# EAGLE design shift register (EAGLE 9.5.2)
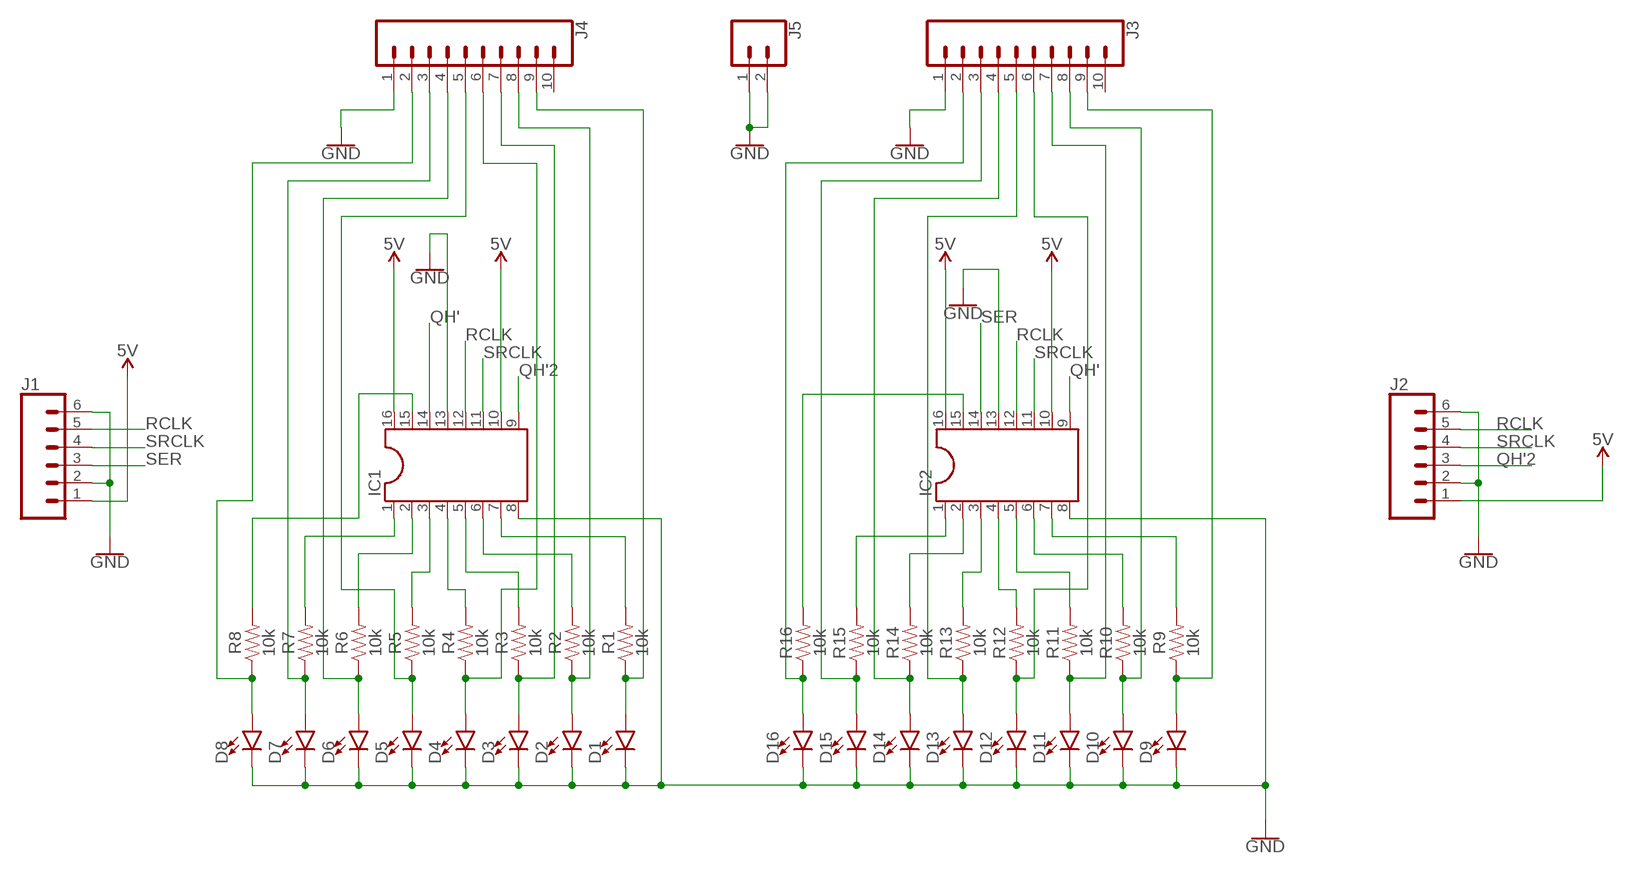
[diagram p0: schematic, sheet 1]

## Parts
D1  LED3MM  [LED_3MM]
D2  LED3MM  [LED_3MM]
D3  LED3MM  [LED_3MM]
D4  LED3MM  [LED_3MM]
D5  LED3MM  [LED_3MM]
D6  LED3MM  [LED_3MM]
D7  LED3MM  [LED_3MM]
D8  LED3MM  [LED_3MM]
D9  LED3MM  [LED_3MM]
D10  LED3MM  [LED_3MM]
D11  LED3MM  [LED_3MM]
D12  LED3MM  [LED_3MM]
D13  LED3MM  [LED_3MM]
D14  LED3MM  [LED_3MM]
D15  LED3MM  [LED_3MM]
D16  LED3MM  [LED_3MM]
IC1  DIL16  [DIL16]
IC2  DIL16  [DIL16]
J1  CONN_06SILK_FEMALE_PTH  [1X06]
J2  CONN_06SILK_FEMALE_PTH  [1X06]
J3  CONN_10"  [1X10]
J4  CONN_10"  [1X10]
J5  CONN_02  [1X02]
R1  10k  10KOHM-HORIZ-1/6W-5%  [AXIAL-0.3]
R2  10k  10KOHM-HORIZ-1/6W-5%  [AXIAL-0.3]
R3  10k  10KOHM-HORIZ-1/6W-5%  [AXIAL-0.3]
R4  10k  10KOHM-HORIZ-1/6W-5%  [AXIAL-0.3]
R5  10k  10KOHM-HORIZ-1/6W-5%  [AXIAL-0.3]
R6  10k  10KOHM-HORIZ-1/6W-5%  [AXIAL-0.3]
R7  10k  10KOHM-HORIZ-1/6W-5%  [AXIAL-0.3]
R8  10k  10KOHM-HORIZ-1/6W-5%  [AXIAL-0.3]
R9  10k  10KOHM-HORIZ-1/6W-5%  [AXIAL-0.3]
R10  10k  10KOHM-HORIZ-1/6W-5%  [AXIAL-0.3]
R11  10k  10KOHM-HORIZ-1/6W-5%  [AXIAL-0.3]
R12  10k  10KOHM-HORIZ-1/6W-5%  [AXIAL-0.3]
R13  10k  10KOHM-HORIZ-1/6W-5%  [AXIAL-0.3]
R14  10k  10KOHM-HORIZ-1/6W-5%  [AXIAL-0.3]
R15  10k  10KOHM-HORIZ-1/6W-5%  [AXIAL-0.3]
R16  10k  10KOHM-HORIZ-1/6W-5%  [AXIAL-0.3]

## Nets
5V: IC1.10 IC1.16 IC2.10 IC2.16 J1.1 J2.1
GND: D1.K(C) D2.K(C) D3.K(C) D4.K(C) D5.K(C) D6.K(C) D7.K(C) D8.K(C) D9.K(C) D10.K(C) D11.K(C) D12.K(C) D13.K(C) D14.K(C) D15.K(C) D16.K(C) IC1.8 IC1.13 IC2.8 IC2.13 J1.2 J1.6 J2.2 J2.6 J3.1 J4.1 J5.1 J5.2
N$1: IC1.7 R1.P$2
N$2: D9.A J3.9 R9.P$1
N$4: D7.A J4.3 R7.P$1
N$5: D6.A J4.4 R6.P$1
N$6: D5.A J4.5 R5.P$1
N$7: D4.A J4.6 R4.P$1
N$8: D3.A J4.7 R3.P$1
N$9: D2.A J4.8 R2.P$1
N$10: D10.A J3.8 R10.P$1
N$11: D11.A J3.7 R11.P$1
N$12: D12.A J3.6 R12.P$1
N$13: D13.A J3.5 R13.P$1
N$14: D14.A J3.4 R14.P$1
N$15: D15.A J3.3 R15.P$1
N$16: D16.A J3.2 R16.P$1
N$19: IC1.15 R8.P$2
N$20: IC2.15 R16.P$2
N$21: D8.A J4.2 R8.P$1
N$22: IC1.6 R2.P$2
N$30: IC2.7 R9.P$2
N$31: IC2.6 R10.P$2
N$38: D1.A J4.9 R1.P$1
N$39: IC1.4 R4.P$2
N$40: IC1.5 R3.P$2
N$42: IC1.3 R5.P$2
N$43: IC1.2 R6.P$2
N$44: IC1.1 R7.P$2
N$46: IC2.1 R15.P$2
N$47: IC2.2 R14.P$2
N$48: IC2.3 R13.P$2
N$49: IC2.4 R12.P$2
N$50: IC2.5 R11.P$2
QH': IC1.14 IC2.9
QH'2: IC1.9 J2.3
RCLK: IC1.12 IC2.12 J1.5 J2.5
SER: IC2.14 J1.3
SRCLK: IC1.11 IC2.11 J1.4 J2.4
Unconnected: J3.10 J4.10

## Library data of the parts
D1-D16 = SparkFun-LED:LED: LED (Generic) Standard schematic elements and footprints for 5mm, 3mm, 1206, and 0603 sized LEDs. Generic LEDs with no color specified.; PROD_ID: DIO-08794
IC1 IC2 = ic-package:DIL16: Dual In Line / Socket
J1 J2 = SparkFun-Connectors:CONN_06: Multi connection point. Often used as Generic Header-pin footprint for 0.1 inch spaced/style header connections On any of the 0.1 inch spaced packages, you can populate with these: Break Away Headers - Straight <https://www.sparkfun.com/products/116> (PRT-00116) Break Away Male Headers - Right Angle <https://www.sparkfun.com/products/553> (PRT-00553) Female Headers <https://www.sparkfun.com/products/115> (PRT-00115) Break Away Headers - Machine Pin <https://www.sparkfun.com/products/117> (PRT-00117) Break Away Female Headers - Swiss Machine Pin <https://www.sparkfun.com/products/743> (PRT-00743) Arduino Stackable Header - 6 Pin <https://www.sparkfun.com/products/9280> (PRT-09280) For SCREWTERMINALS and SPRING TERMINALS visit here: Screw Terimnals on SparkFun.com <https://www.sparkfun.com/search/results?term=Screw+Terminals> (5mm/3.5mm/2.54mm spacing) This device is also useful as a general connection point to wire up your design to another part of your project. Our various solder wires solder well into these plated through hole pads. Hook-Up Wire - Assortment (Stranded, 22 AWG) <https://www.sparkfun.com/products/11375> (PRT-11375) Hook-Up Wire - Assortment (Solid Core, 22 AWG) <https://www.sparkfun.com/products/11367> (PRT-11367) View the entire wire category on our website here <https://www.sparkfun.com/categories/141>; PROD_ID: CONN-08437
J3 J4 = SparkFun-Connectors:CONN_10: Multi connection point. Often used as Generic Header-pin footprint for 0.1 inch spaced/style header connections On any of the 0.1 inch spaced packages, you can populate with these: Break Away Headers - Straight <https://www.sparkfun.com/products/116> (PRT-00116) Break Away Male Headers - Right Angle <https://www.sparkfun.com/products/553> (PRT-00553) Female Headers <https://www.sparkfun.com/products/115> (PRT-00115) Break Away Headers - Machine Pin <https://www.sparkfun.com/products/117> (PRT-00117) Break Away Female Headers - Swiss Machine Pin <https://www.sparkfun.com/products/743> (PRT-00743) Arduino Stackable Header - 10 Pin <https://www.sparkfun.com/products/11376> (PRT-11376) For SCREWTERMINALS and SPRING TERMINALS visit here: Screw Terimnals on SparkFun.com <https://www.sparkfun.com/search/results?term=Screw+Terminals> (5mm/3.5mm/2.54mm spacing) This device is also useful as a general connection point to wire up your design to another part of your project. Our various solder wires solder well into these plated through hole pads. Hook-Up Wire - Assortment (Stranded, 22 AWG) <https://www.sparkfun.com/products/11375> (PRT-11375) Hook-Up Wire - Assortment (Solid Core, 22 AWG) <https://www.sparkfun.com/products/11367> (PRT-11367) View the entire wire category on our website here <https://www.sparkfun.com/categories/141> Special notes: Molex polarized connector foot print use with SKU : PRT-08231 with associated crimp pins and housings. 1MM SMD Version SKU: PRT-10208 NOTES ON THE VARIANTS LOCK and LOCK_LONGPADS... This footprint was designed to help hold the alignment of a through-hole component (i.e. 6-pin header) while soldering it into place. You may notice that each hole has been shifted either up or down by 0.005 of an inch from it's more standard position (which is a perfectly straight line). This slight alteration caused the pins (the squares in the middle) to touch the edges of the holes. Because they are alternating, it causes a "brace" to hold the component in place. 0.005 has proven to be the perfect amount of "off-center" position when using our standard breakaway headers. Although looks a little odd when you look at the bare footprint, once you have a header in there, the alteration is very hard to notice. Also,if you push a header all the way into place, it is covered up entirely on the bottom side.; PROD_ID: CONN-11563
J5 = SparkFun-Connectors:CONN_02: Multi connection point. Often used as Generic Header-pin footprint for 0.1 inch spaced/style header connections On any of the 0.1 inch spaced packages, you can populate with these: Break Away Headers - Straight <https://www.sparkfun.com/products/116> (PRT-00116) Break Away Male Headers - Right Angle <https://www.sparkfun.com/products/553> (PRT-00553) Female Headers <https://www.sparkfun.com/products/115> (PRT-00115) Break Away Headers - Machine Pin <https://www.sparkfun.com/products/117> (PRT-00117) Break Away Female Headers - Swiss Machine Pin <https://www.sparkfun.com/products/743> (PRT-00743) For SCREWTERMINALS and SPRING TERMINALS visit here: Screw Terimnals on SparkFun.com <https://www.sparkfun.com/search/results?term=Screw+Terminals> (5mm/3.5mm/2.54mm spacing) This device is also useful as a general connection point to wire up your design to another part of your project. Our various solder wires solder well into these plated through hole pads. Hook-Up Wire - Assortment (Stranded, 22 AWG) <https://www.sparkfun.com/products/11375> (PRT-11375) Hook-Up Wire - Assortment (Solid Core, 22 AWG) <https://www.sparkfun.com/products/11367> (PRT-11367) View the entire wire category on our website here <https://www.sparkfun.com/categories/141> Special notes: Molex polarized connector foot print use with: PRT-08233 with associated crimp pins and housings. 2.54_SCREWTERM for use with PRT-10571. 3.5mm Screw Terminal footprints for PRT-08084 5mm Screw Terminal footprints for use with PRT-08432
R1-R16 = SparkFun-Resistors:10KOHM: 10kΩ resistor A resistor is a passive two-terminal electrical component that implements electrical resistance as a circuit element. Resistors act to reduce current flow, and, at the same time, act to lower voltage levels within circuits. - Wikipedia; PROD_ID: RES-08375

## Board
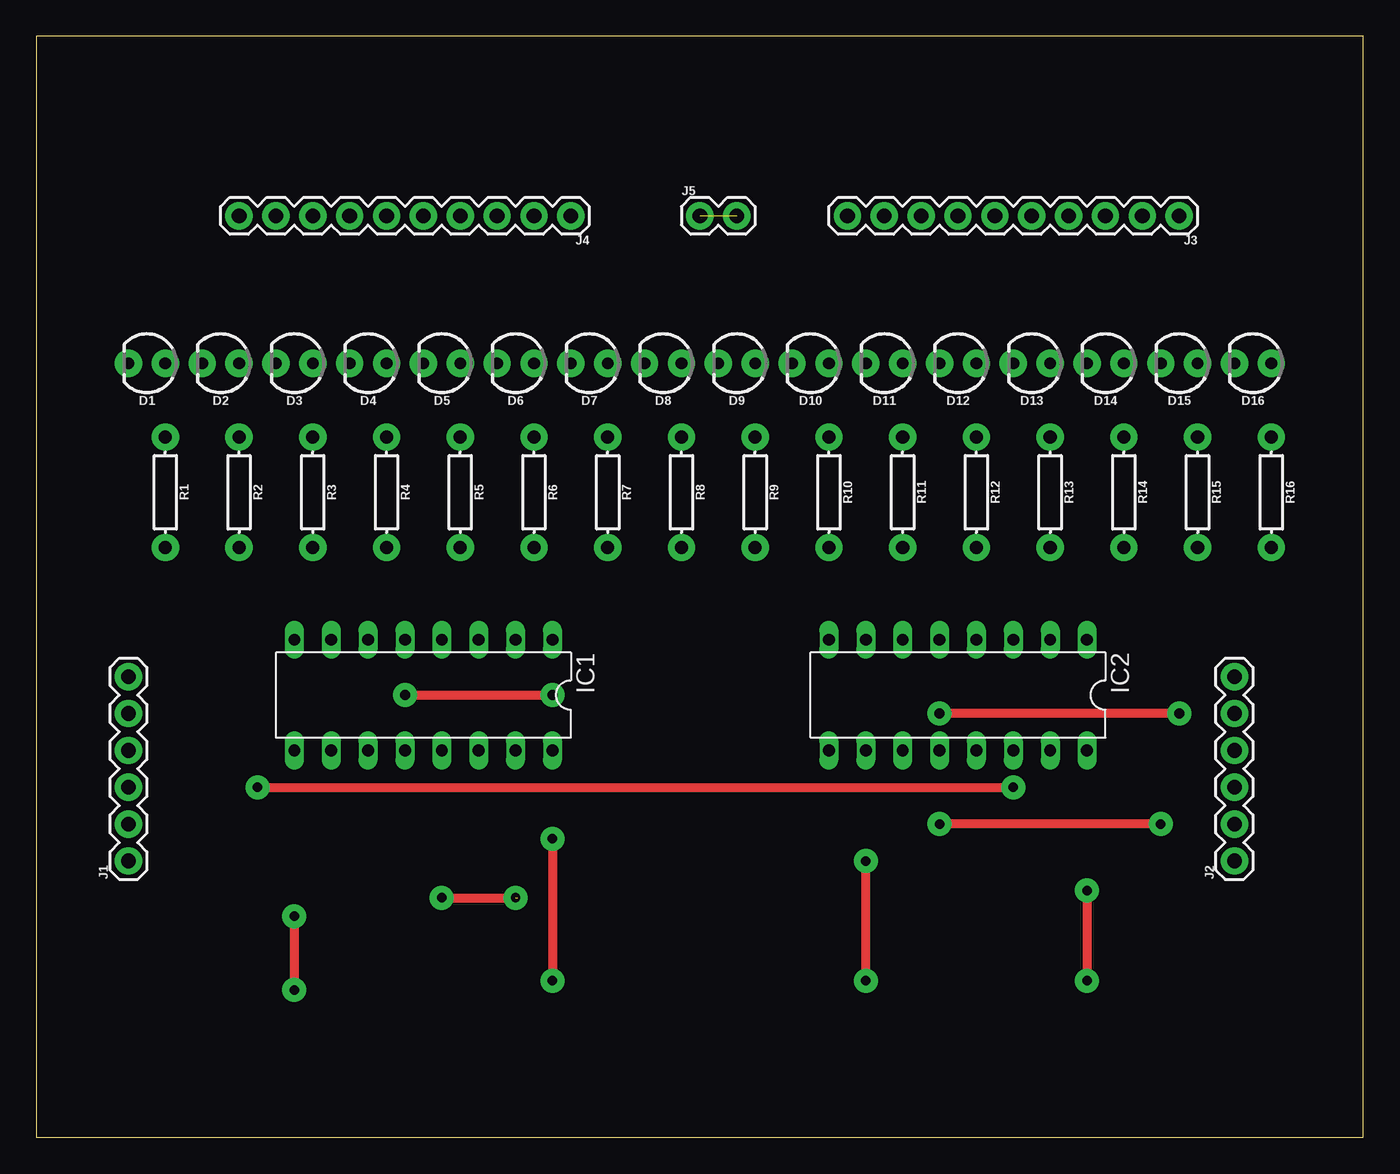
[diagram p1: board, top side]
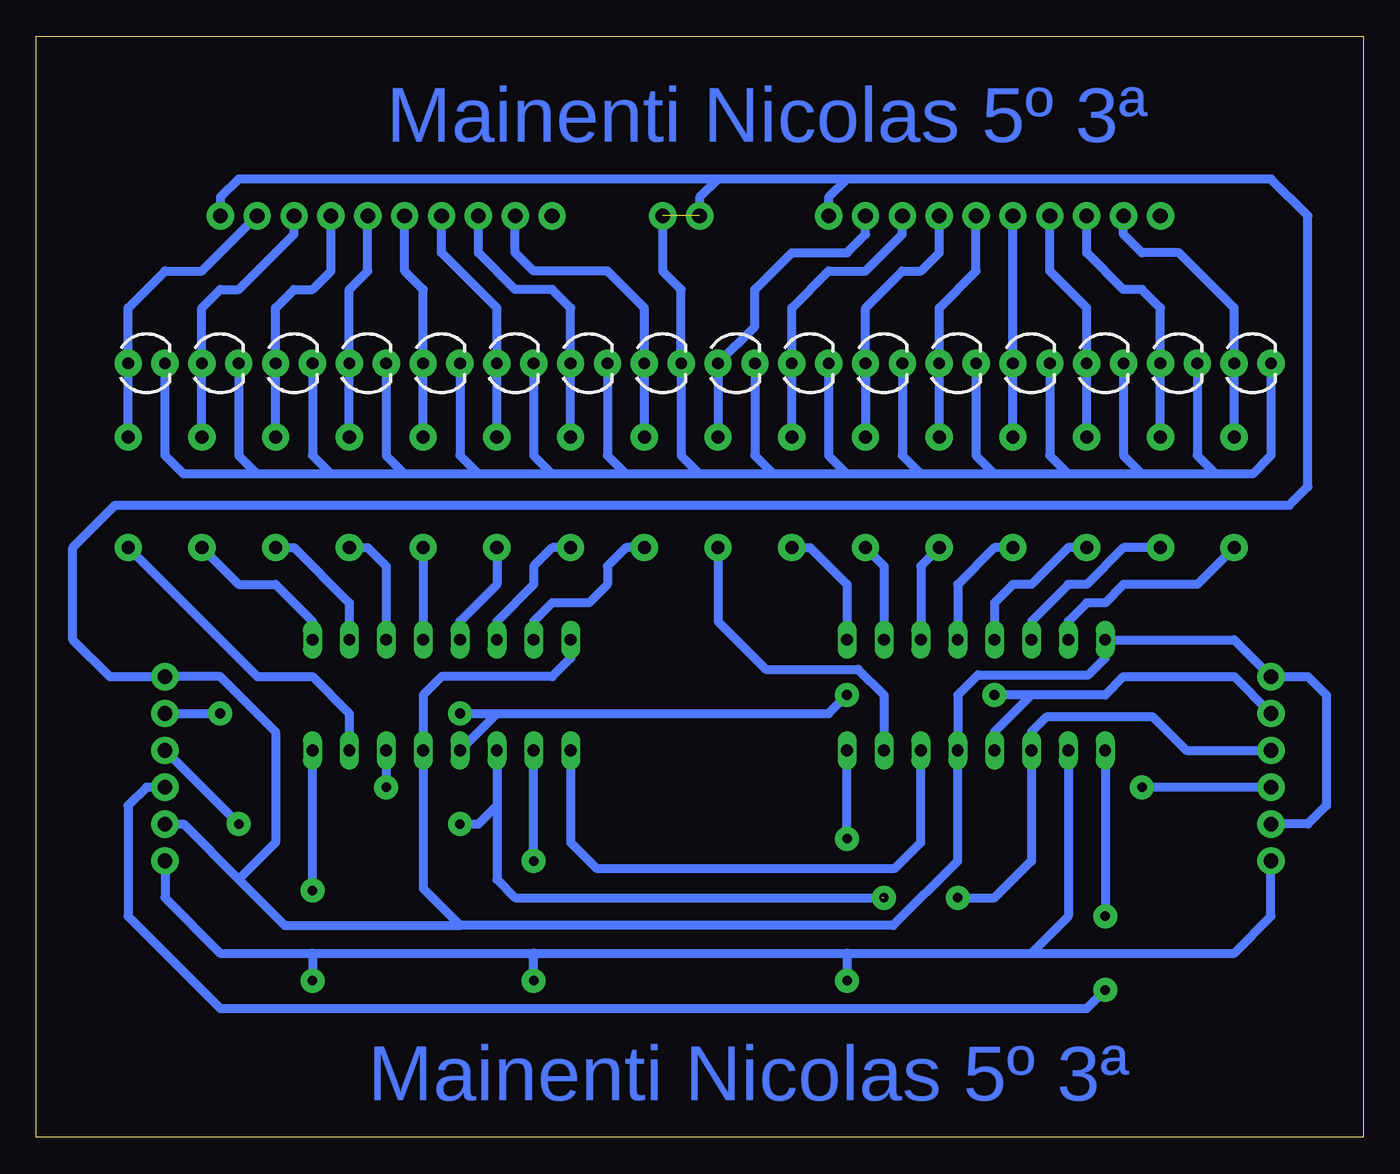
[diagram p2: board, bottom side, seen from below]

Size 91.42 x 75.87 mm. Coordinates in mm from the lower left corner, seen from the top.
Outline: 0,0 91.42,0 91.42,75.87 0,75.87 0,0
Copper layers (1*16): Top 0.035mm / dielectric 1.5mm / Bottom 0.035mm
Design rules "default *": minimum track width 24mil, minimum drill 0.35mm, track to track 16mil, track to pad 6mil, pad to pad 6mil, via to via 6mil, smd to smd 6mil, copper to edge 40mil, drill to drill 6mil, minimum pad ring 10mil, minimum via ring 8mil, stop-mask expansion 4mil, vias tented up to drill 0mil, thermal gap 10mil

### Footprints (pad centres in the part's own frame; a part is rotated, then mirrored left to right if it is on the bottom)
LED_3MM = drill 0.813 pad 1.88: A -1.27,0; K 1.27,0
DIL16 = drill 0.813 long: 1 -8.89,-3.81; 2 -6.35,-3.81; 3 -3.81,-3.81; 4 -1.27,-3.81; 5 1.27,-3.81; 6 3.81,-3.81; 7 6.35,-3.81; 8 8.89,-3.81; 9 8.89,3.81; 10 6.35,3.81; 11 3.81,3.81; 12 1.27,3.81; 13 -1.27,3.81; 14 -3.81,3.81; 15 -6.35,3.81; 16 -8.89,3.81
1X06 = drill 1.016 pad 1.88: 1 0,0; 2 2.54,0; 3 5.08,0; 4 7.62,0; 5 10.16,0; 6 12.7,0
1X10 = drill 1.016 pad 1.88: 1 0,0; 2 2.54,0; 3 5.08,0; 4 7.62,0; 5 10.16,0; 6 12.7,0; 7 15.24,0; 8 17.78,0; 9 20.32,0; 10 22.86,0
1X02 = drill 1.016 pad 1.88: 1 0,0; 2 2.54,0
AXIAL-0.3 = drill 0.9 pad 1.88: P$1 -3.81,0; P$2 3.81,0

### Placement (x,y rotation side)
D1  7.62,53.34 180 top
D2  12.7,53.34 180 top
D3  17.78,53.34 180 top
D4  22.86,53.34 180 top
D5  27.94,53.34 180 top
D6  33.02,53.34 180 top
D7  38.1,53.34 180 top
D8  43.18,53.34 180 top
D9  48.26,53.34 180 top
D10  53.34,53.34 180 top
D11  58.42,53.34 180 top
D12  63.5,53.34 180 top
D13  68.58,53.34 180 top
D14  73.66,53.34 180 top
D15  78.74,53.34 180 top
D16  83.82,53.34 180 top
IC1  26.67,30.48 180 top
IC2  63.5,30.48 180 top
J1  6.35,19.05 90 top
J2  82.55,19.05 90 top
J3  78.74,63.5 180 top
J4  36.83,63.5 180 top
J5  45.72,63.5 0 top
R1  8.89,44.45 270 top
R2  13.97,44.45 270 top
R3  19.05,44.45 270 top
R4  24.13,44.45 270 top
R5  29.21,44.45 270 top
R6  34.29,44.45 270 top
R7  39.37,44.45 270 top
R8  44.45,44.45 270 top
R9  49.53,44.45 270 top
R10  54.61,44.45 270 top
R11  59.69,44.45 270 top
R12  64.77,44.45 270 top
R13  69.85,44.45 270 top
R14  74.93,44.45 270 top
R15  80.01,44.45 270 top
R16  85.09,44.45 270 top

### Tracks (layer width: path | path; a pad name or v marks a point on that pad's centre or on a via)
5V  (via drill 0.65 pad 1.65)
  Top 0.61: v72.39,17.02 v72.39,10.8 | v57.15,10.8 v57.15,19.05 | v35.56,20.57 v35.56,10.8
  Bottom 0.61: J2.1 82.55,16.51 78.74,12.7 72.39,12.7 | 72.39,12.7 57.15,12.7 | 57.15,12.7 35.56,12.7 | 35.56,12.7 22.86,12.7 | 22.86,12.7 8.89,12.7 6.35,15.24 J1.1 | IC1.10 20.32,15.24 22.86,12.7 | 72.39,12.7 v72.39,10.8 | v72.39,17.02 IC2.16 | v57.15,10.8 57.15,12.7 | v57.15,19.05 IC2.10 | v35.56,20.57 IC1.16 | 35.56,12.7 v35.56,10.8
GND  (1 unrouted)
  Bottom 0.61: 35.56,66.04 36.83,64.77 J4.1 | 35.56,66.04 6.35,66.04 3.81,63.5 3.81,44.83 5.08,43.56 85.98,43.56 88.9,40.64 88.9,34.29 86.36,31.75 J2.6 78.74,31.75 74.93,27.94 74.93,20.32 77.47,17.78 | 35.56,66.04 44.45,66.04 | 44.45,66.04 77.47,66.04 78.74,64.77 J3.1 | 44.45,66.04 45.72,64.77 J5.1 | D1.K 6.35,46.99 7.62,45.72 10.16,45.72 | 10.16,45.72 15.24,45.72 | 15.24,45.72 20.32,45.72 | 20.32,45.72 25.4,45.72 | 25.4,45.72 30.48,45.72 | 30.48,45.72 35.56,45.72 | 35.56,45.72 40.64,45.72 | 40.64,45.72 45.72,45.72 | 45.72,45.72 50.8,45.72 | 50.8,45.72 55.88,45.72 | 55.88,45.72 60.96,45.72 | 60.96,45.72 66.04,45.72 | 66.04,45.72 71.12,45.72 | 71.12,45.72 76.2,45.72 | 76.2,45.72 81.28,45.72 82.55,46.99 D16.K | D15.K 77.47,46.99 76.2,45.72 | D14.K 72.39,46.99 71.12,45.72 | D13.K 67.31,46.99 66.04,45.72 | D12.K 62.23,46.99 60.96,45.72 | D11.K 57.15,46.99 55.88,45.72 | D10.K 52.07,46.99 50.8,45.72 | 45.72,45.72 46.99,46.99 D9.K 46.99,58.42 48.26,59.69 J5.2 | D8.K 41.91,46.99 40.64,45.72 | D7.K 36.83,46.99 35.56,45.72 | D6.K 31.75,46.99 30.48,45.72 | D5.K 26.67,46.99 25.4,45.72 | D4.K 21.59,46.99 20.32,45.72 | D3.K 16.51,46.99 15.24,45.72 | D2.K 11.43,46.99 10.16,45.72 | IC2.8 54.61,33.02 55.88,31.75 63.5,31.75 64.77,30.48 IC2.13 64.77,17.14 62.23,14.61 | J1.2 3.81,21.59 2.54,22.86 2.54,30.48 3.81,31.75 J1.6 8.89,34.29 IC1.8 17.78,33.02 18.92,31.88 26.54,31.88 27.94,30.48 IC1.13 27.94,19.05 32.38,14.61 62.23,14.61 | J2.2 81.28,21.59 77.47,17.78 | 62.23,14.61 74.29,14.61 77.47,17.78
N$1
  Bottom 0.61: R1.P$2 11.43,38.1 16.51,38.1 17.78,36.83 19.05,36.83 20.32,35.56 IC1.7
N$2
  Bottom 0.61: R9.P$1 D9.A 49.53,57.15 52.07,59.69 57.15,59.69 58.42,60.96 J3.9
N$4
  Bottom 0.61: R7.P$1 D7.A 39.37,57.15 36.83,59.69 34.29,59.69 31.75,62.23 J4.3
N$5
  Bottom 0.61: R6.P$1 D6.A 34.29,57.15 31.75,59.69 30.48,59.69 29.21,60.96 J4.4
N$6
  Bottom 0.61: R5.P$1 D5.A 29.21,57.15 26.67,59.69 J4.5
N$7
  Bottom 0.61: J4.6 D4.A R4.P$1
N$8
  Bottom 0.61: R3.P$1 D3.A 19.05,57.15 21.59,59.69 J4.7
N$9
  Bottom 0.61: R2.P$1 D2.A 13.97,57.15 15.24,58.42 16.51,58.42 19.05,60.96 J4.8
N$10
  Bottom 0.61: R10.P$1 D10.A 54.61,57.15 55.88,58.42 58.42,58.42 60.96,60.96 J3.8
N$11
  Bottom 0.61: R11.P$1 D11.A 59.69,57.15 63.5,60.96 J3.7
N$12
  Bottom 0.61: R12.P$1 D12.A 64.77,58.42 66.04,59.69 J3.6
N$13
  Bottom 0.61: R13.P$1 D13.A 69.85,58.42 68.58,59.69 J3.5
N$14
  Bottom 0.61: R14.P$1 D14.A 74.93,57.15 73.66,58.42 72.39,58.42 71.12,59.69 J3.4
N$15
  Bottom 0.61: R15.P$1 D15.A 80.01,57.15 78.74,58.42 77.47,58.42 73.66,62.23 J3.3
N$16
  Bottom 0.61: R16.P$1 D16.A 85.09,57.15 82.55,59.69 80.01,59.69 J3.2
N$19
  Bottom 0.61: R8.P$2 44.45,35.56 41.15,32.26 34.8,32.26 33.02,30.48 IC1.15
N$20
  Bottom 0.61: R16.P$2 76.2,31.75 72.39,31.75 69.85,29.21 IC2.15
N$21
  Bottom 0.61: R8.P$1 D8.A 41.91,55.88 41.91,58.42 39.37,60.96 35.56,60.96 34.29,62.23 J4.2
N$22
  Bottom 0.61: R2.P$2 16.51,40.64 19.05,38.1 20.32,38.1 22.86,35.56 IC1.6
N$30
  Bottom 0.61: R9.P$2 50.8,40.64 52.07,39.37 52.07,38.1 53.34,36.83 55.88,36.83 57.15,35.56 IC2.7
N$31
  Bottom 0.61: R10.P$2 55.88,40.64 57.15,39.37 57.15,38.1 59.69,35.56 IC2.6
N$38
  Bottom 0.61: R1.P$1 D1.A 8.89,57.15 12.7,60.96 15.24,60.96 16.51,62.23 J4.9
N$39
  Bottom 0.61: R4.P$2 25.4,40.64 27.94,38.1 IC1.4
N$40
  Bottom 0.61: R3.P$2 20.32,40.64 22.86,38.1 24.13,38.1 25.4,36.83 IC1.5
N$42
  Bottom 0.61: R5.P$2 30.48,39.37 IC1.3
N$43
  Bottom 0.61: R6.P$2 33.02,39.37 IC1.2
N$44
  Bottom 0.61: R7.P$2 38.1,40.64 35.56,38.1 IC1.1
N$46
  Bottom 0.61: R15.P$2 77.47,38.1 74.93,38.1 72.39,35.56 IC2.1
N$47
  Bottom 0.61: R14.P$2 73.66,40.64 69.85,36.83 IC2.2
N$48
  Bottom 0.61: R13.P$2 68.58,40.64 67.31,39.37 IC2.3
N$49
  Bottom 0.61: R12.P$2 IC2.4
N$50
  Bottom 0.61: R11.P$2 59.69,38.1 62.23,35.56 IC2.5
QH'
  Bottom 0.61: IC2.9 54.61,20.32 52.83,18.54 32.26,18.54 30.48,20.32 IC1.14
QH'2  (via drill 0.65 pad 1.65)
  Top 0.61: v17.78,15.24 v17.78,10.16
  Bottom 0.61: J2.3 83.82,24.13 85.09,22.86 85.09,15.24 78.74,8.89 19.05,8.89 v17.78,10.16 | IC1.9 v17.78,15.24
RCLK  (via drill 0.35, 0.7 pad 1.65)
  Top 0.61: v78.74,29.21 v62.23,29.21 | v25.4,30.48 v35.56,30.48
  Bottom 0.61: 22.86,30.48 25.4,27.94 IC1.12 | 22.86,30.48 17.78,30.48 16.51,31.75 8.89,31.75 J1.5 | 22.86,30.48 v25.4,30.48 | v35.56,30.48 36.83,29.21 59.69,29.21 | v62.23,29.21 59.69,29.21 | J2.5 v78.74,29.21 | IC2.12 59.69,29.21
SER  (via drill 0.65 pad 1.65)
  Top 0.61: v15.24,24.13 v67.31,24.13
  Bottom 0.61: J1.3 v15.24,24.13 | IC2.14 v67.31,24.13
SRCLK  (via drill 0.65 pad 1.65)  (1 unrouted)
  Top 0.61: v77.47,21.59 v62.23,21.59 | v27.94,16.51 v33.02,16.51
  Bottom 0.61: J1.4 12.19,26.67 14.48,28.96 21.84,28.96 22.86,27.94 IC1.11 22.86,19.05 25.4,16.51 v27.94,16.51 | v62.23,21.59 60.96,21.59 59.69,22.86 | IC2.11 59.69,22.86 | v77.47,21.59 J2.4 | 33.15,16.51 58.42,16.51 59.69,17.78 59.69,22.86

### Text on the board
Bottom: Mainenti Nicolas 5º 3ª | Mainenti Nicolas 5º 3ª